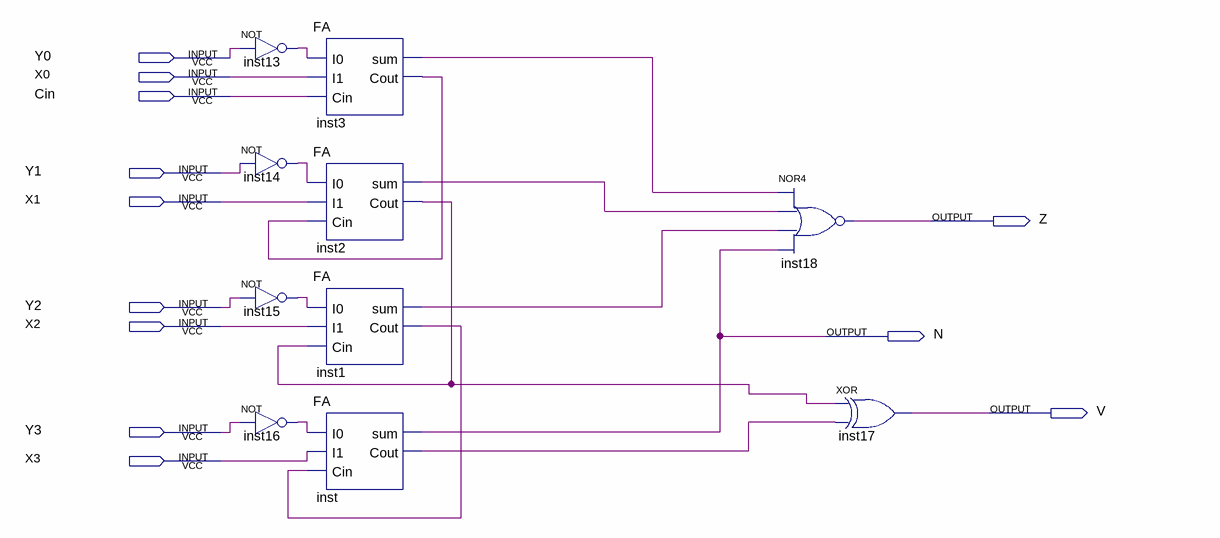
[diagram p0: schematic sheet]
// Quartus schematic Block1.bdf as structural Verilog: 10 symbols, 12 pins
module Block1 (
  input  Y0,
  input  X0,
  input  Cin,
  input  Y1,
  input  X1,
  input  Y2,
  input  X2,
  input  Y3,
  input  X3,
  output Z,
  output N,
  output V
);

  wire inst1_cout, inst1_sum, inst2_cout, inst2_sum, inst3_cout, inst3_sum, inst13_out, inst14_out,
       inst15_out, inst16_out, inst_cout;

  not inst13 (inst13_out, Y0);
  not inst14 (inst14_out, Y1);
  not inst15 (inst15_out, Y2);
  not inst16 (inst16_out, Y3);
  FA inst3 (.I0(inst13_out), .I1(X0), .Cin(Cin), .sum(inst3_sum), .Cout(inst3_cout));
  FA inst2 (.I0(inst14_out), .I1(X1), .Cin(inst3_cout), .sum(inst2_sum), .Cout(inst2_cout));
  FA inst1 (.I0(inst15_out), .I1(X2), .Cin(inst2_cout), .sum(inst1_sum), .Cout(inst1_cout));
  FA inst (.I0(inst16_out), .I1(X3), .Cin(inst1_cout), .sum(N), .Cout(inst_cout));
  nor inst18 (Z, inst3_sum, inst2_sum, inst1_sum, N);
  xor inst17 (V, inst2_cout, inst_cout);
endmodule
